# Altium project 无刷电机驱动.PrjPcb
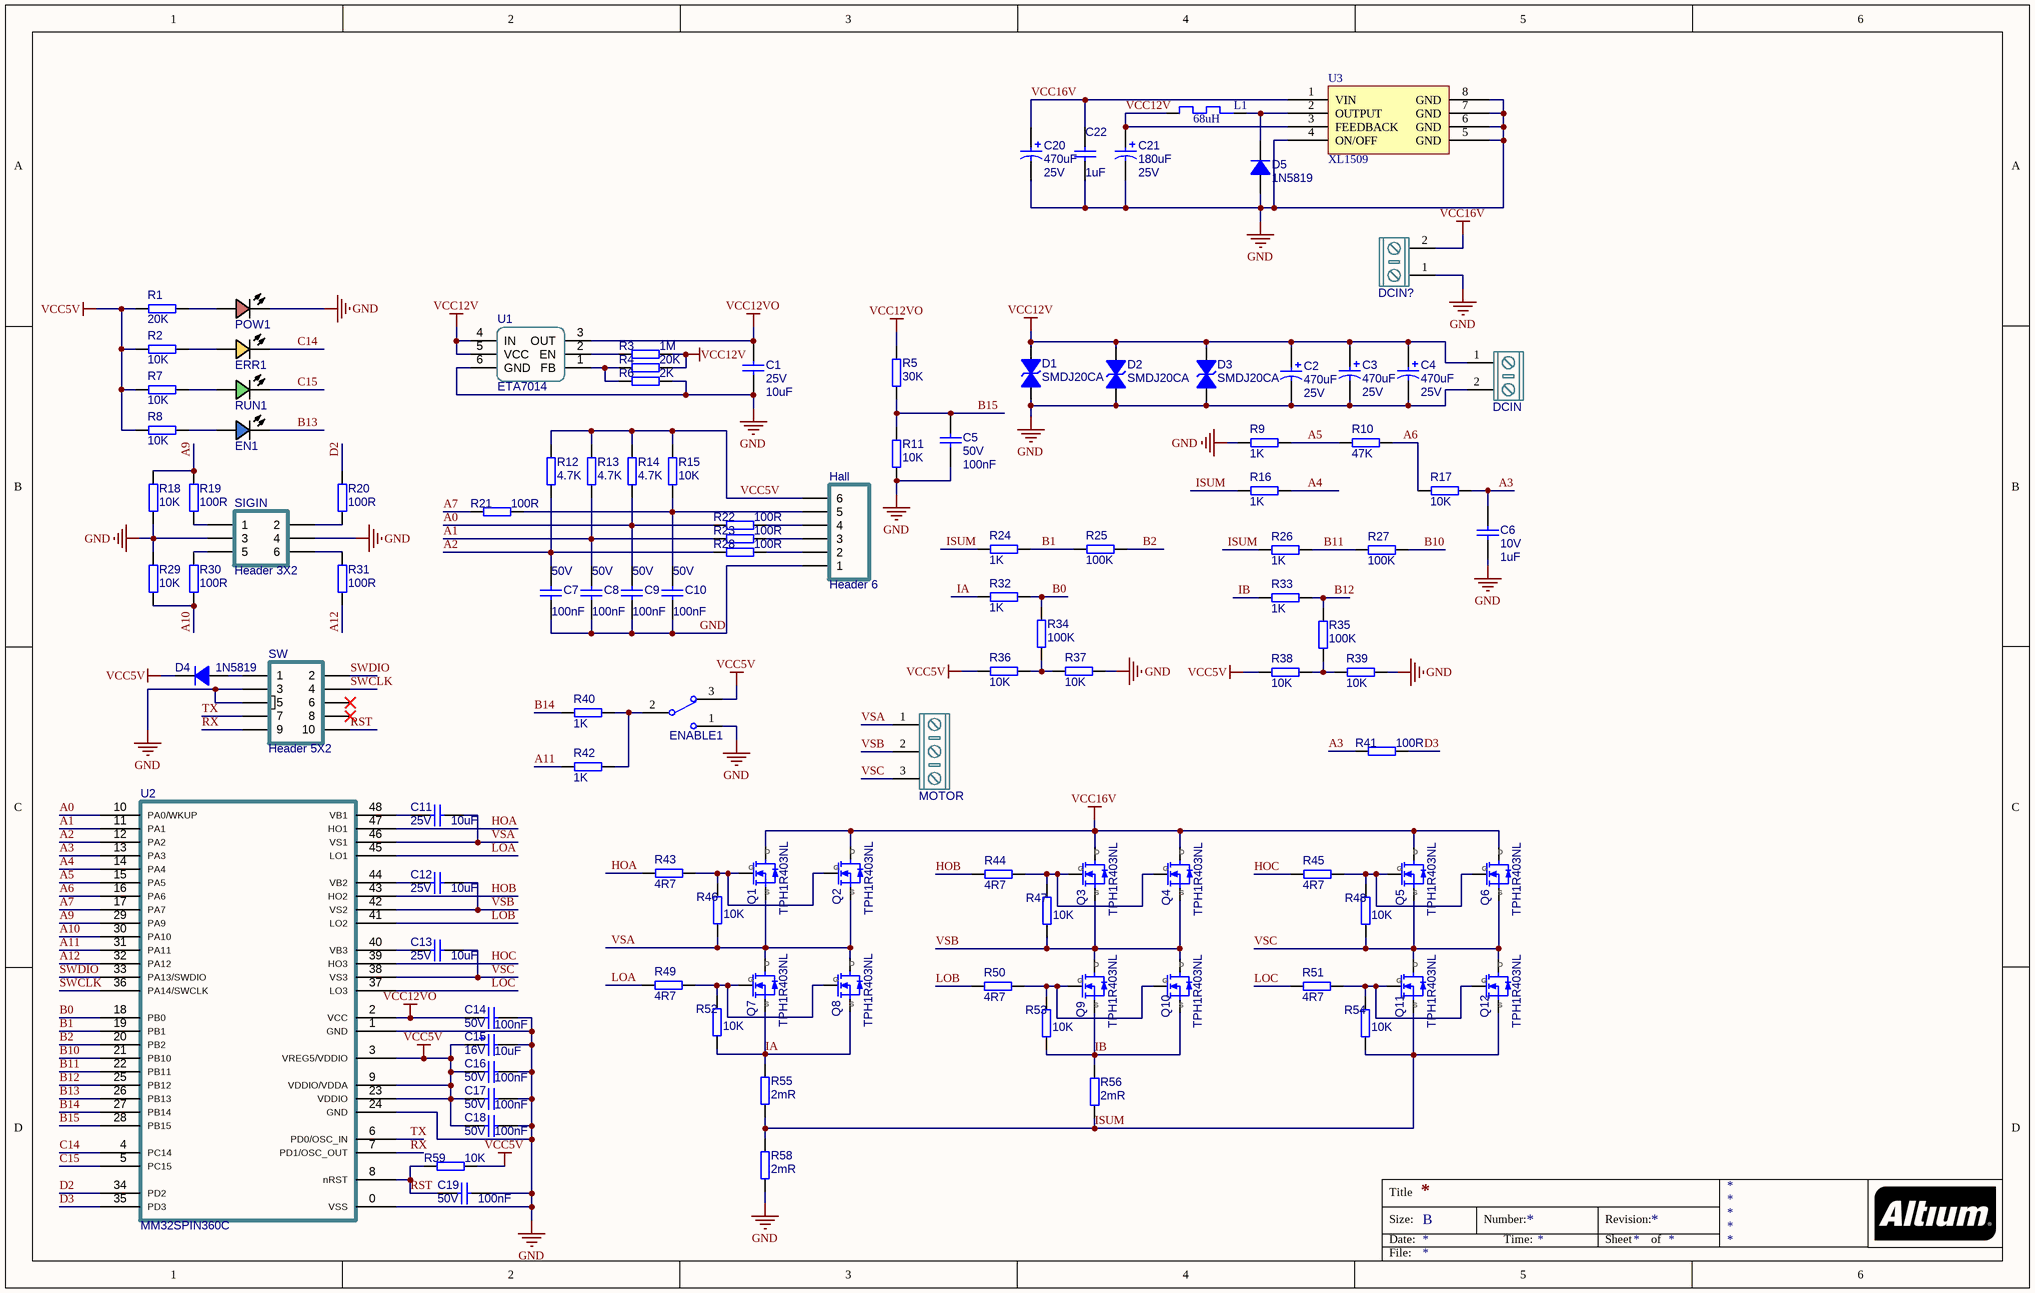
[diagram p0: Sheet1.SchDoc]
1 sheet, 112 parts. Net scope: global (net labels, ports and power ports of the same name join across sheets).
Board file: 四层板V2.0.PcbDoc

## Sheet Sheet1.SchDoc
size B

### Parts
C1  value 10uF  Voltage: 25V  [CAPC2012[0805]S-N]  (hidden comment: 10uF ±10% 25V)
C2  value 470uF  Voltage: 25V  [CAPPR3.5-8X12]  (hidden comment: 470uF 25V)
C3  value 470uF  Voltage: 25V  [CAPPR3.5-8X12]  (hidden comment: 470uF 25V)
C4  value 470uF  Voltage: 25V  [CAPPR3.5-8X12]  (hidden comment: 470uF 25V)
C5  value 100nF  Voltage: 50V  [RESC1608[0603]S-N]  (hidden comment: 100nF ±10% 50V)
C6  value 1uF  Voltage: 10V  [RESC1608[0603]S-N]  (hidden comment: 1uF ±10% 10V)
C7  value 100nF  Voltage: 50V  [RESC1608[0603]S-N]  (hidden comment: 100nF ±10% 50V)
C8  value 100nF  Voltage: 50V  [RESC1608[0603]S-N]  (hidden comment: 100nF ±10% 50V)
C9  value 100nF  Voltage: 50V  [RESC1608[0603]S-N]  (hidden comment: 100nF ±10% 50V)
C10  value 100nF  Voltage: 50V  [RESC1608[0603]S-N]  (hidden comment: 100nF ±10% 50V)
C11  value 10uF  Voltage: 25V  [CAPC2012[0805]S-N]  (hidden comment: 10uF ±10% 25V)
C12  value 10uF  Voltage: 25V  [CAPC2012[0805]S-N]  (hidden comment: 10uF ±10% 25V)
C13  value 10uF  Voltage: 25V  [CAPC2012[0805]S-N]  (hidden comment: 10uF ±10% 25V)
C14  value 100nF  Voltage: 50V  [RESC1608[0603]S-N]  (hidden comment: 100nF ±10% 50V)
C15  value 10uF  Voltage: 16V  [CAPT3216]  (hidden comment: 10uF 16V)
C16  value 100nF  Voltage: 50V  [RESC1608[0603]S-N]  (hidden comment: 100nF ±10% 50V)
C17  value 100nF  Voltage: 50V  [RESC1608[0603]S-N]  (hidden comment: 100nF ±10% 50V)
C18  value 100nF  Voltage: 50V  [RESC1608[0603]S-N]  (hidden comment: 100nF ±10% 50V)
C19  value 100nF  Voltage: 50V  [RESC1608[0603]S-N]  (hidden comment: 100nF ±10% 50V)
C20  value 470uF  Voltage: 25V  [CAPPR3.5-8X12]  (hidden comment: 470uF 25V)
C21  value 180uF  Voltage: 25V  [CAPPR3.5-8X12]  (hidden comment: 180uF 25V)
C22  value 1uF  [CAPC2012[0805]S-N]  (hidden comment: 1uF ±10% 25V)
D1  SMDJ20CA  [SMC[DO-214AB]]
D2  SMDJ20CA  [SMC[DO-214AB]]
D3  SMDJ20CA  [SMC[DO-214AB]]
D4  1N5819  [SOD-123-L]
D5  1N5819  [SOD-123-L]
DCIN  KF/WJ/DG 30x connecter  [KF/WJ/DG 301-2p-5.0mm]  (value not drawn)
DCIN?  KF/WJ/DG 30x connecter  [KF/WJ/DG 301-2p-5.0mm]  (value not drawn)
EN1  蓝色贴片LED  [CAPC2012[0805]S-N]  (value not drawn)
ENABLE1  SW-SPDT  [SS12D10]  (value not drawn)
ERR1  黄色贴片LED  [CAPC2012[0805]S-N]  (value not drawn)
Hall  Header 6  [ZH1.5-WF-6P]
L1  68uH  [L1]
MOTOR  KF/WJ/DG 30x connecter  [KF/WJ/DG 301-3p-5.0mm]  (value not drawn)
POW1  红色贴片LED  [CAPC2012[0805]S-N]  (value not drawn)
Q1  TPH1R403NL  [DFN5x6]
Q2  TPH1R403NL  [DFN5x6]
Q3  TPH1R403NL  [DFN5x6]
Q4  TPH1R403NL  [DFN5x6]
Q5  TPH1R403NL  [DFN5x6]
Q6  TPH1R403NL  [DFN5x6]
Q7  TPH1R403NL  [DFN5x6]
Q8  TPH1R403NL  [DFN5x6]
Q9  TPH1R403NL  [DFN5x6]
Q10  TPH1R403NL  [DFN5x6]
Q11  TPH1R403NL  [DFN5x6]
Q12  TPH1R403NL  [DFN5x6]
R1  value 20K  [RESC1608[0603]S-N]  (hidden comment: 20K ±1%)
R2  value 10K  [RESC1608[0603]S-N]  (hidden comment: 10K ±1%)
R3  value 1M  [RESC1608[0603]S-N]  (hidden comment: 1M ±1%)
R4  value 20K  [RESC1608[0603]S-N]  (hidden comment: 20K ±1%)
R5  value 30K  [RESC1608[0603]S-N]  (hidden comment: 30K ±1%)
R6  value 2K  [RESC1608[0603]S-N]  (hidden comment: 2K ±1%)
R7  value 10K  [RESC1608[0603]S-N]  (hidden comment: 10K ±1%)
R8  value 10K  [RESC1608[0603]S-N]  (hidden comment: 10K ±1%)
R9  value 1K  [RESC1608[0603]S-N]  (hidden comment: 1K ±1%)
R10  value 47K  [RESC1608[0603]S-N]  (hidden comment: 47K ±1%)
R11  value 10K  [RESC1608[0603]S-N]  (hidden comment: 10K ±1%)
R12  value 4.7K  [RESC1608[0603]S-N]  (hidden comment: 4.7K ±1%)
R13  value 4.7K  [RESC1608[0603]S-N]  (hidden comment: 4.7K ±1%)
R14  value 4.7K  [RESC1608[0603]S-N]  (hidden comment: 4.7K ±1%)
R15  value 10K  [RESC1608[0603]S-N]  (hidden comment: 10K ±1%)
R16  value 1K  [RESC1608[0603]S-N]  (hidden comment: 1K ±1%)
R17  value 10K  [RESC1608[0603]S-N]  (hidden comment: 10K ±1%)
R18  value 10K  [RESC1608[0603]S-N]  (hidden comment: 10K ±1%)
R19  value 100R  [RESC1608[0603]S-N]  (hidden comment: 100R ±1%)
R20  value 100R  [RESC1608[0603]S-N]  (hidden comment: 100R ±1%)
R21  value 100R  [RESC1608[0603]S-N]  (hidden comment: 100R ±1%)
R22  value 100R  [RESC1608[0603]S-N]  (hidden comment: 100R ±1%)
R23  value 100R  [RESC1608[0603]S-N]  (hidden comment: 100R ±1%)
R24  value 1K  [RESC1608[0603]S-N]  (hidden comment: 1K ±1%)
R25  value 100K  [RESC1608[0603]S-N]  (hidden comment: 100K ±1%)
R26  value 1K  [RESC1608[0603]S-N]  (hidden comment: 1K ±1%)
R27  value 100K  [RESC1608[0603]S-N]  (hidden comment: 100K ±1%)
R28  value 100R  [RESC1608[0603]S-N]  (hidden comment: 100R ±1%)
R29  value 10K  [RESC1608[0603]S-N]  (hidden comment: 10K ±1%)
R30  value 100R  [RESC1608[0603]S-N]  (hidden comment: 100R ±1%)
R31  value 100R  [RESC1608[0603]S-N]  (hidden comment: 100R ±1%)
R32  value 1K  [RESC1608[0603]S-N]  (hidden comment: 1K ±1%)
R33  value 1K  [RESC1608[0603]S-N]  (hidden comment: 1K ±1%)
R34  value 100K  [RESC1608[0603]S-N]  (hidden comment: 100K ±1%)
R35  value 100K  [RESC1608[0603]S-N]  (hidden comment: 100K ±1%)
R36  value 10K  [RESC1608[0603]S-N]  (hidden comment: 10K ±1%)
R37  value 10K  [RESC1608[0603]S-N]  (hidden comment: 10K ±1%)
R38  value 10K  [RESC1608[0603]S-N]  (hidden comment: 10K ±1%)
R39  value 10K  [RESC1608[0603]S-N]  (hidden comment: 10K ±1%)
R40  value 1K  [RESC1608[0603]S-N]  (hidden comment: 1K ±1%)
R41  value 100R  [RESC1608[0603]S-N]  (hidden comment: 100R ±1%)
R42  value 1K  [RESC1608[0603]S-N]  (hidden comment: 1K ±1%)
R43  value 4R7  [RESC1608[0603]S-N]  (hidden comment: 4R7 ±1%)
R44  value 4R7  [RESC1608[0603]S-N]  (hidden comment: 4R7 ±1%)
R45  value 4R7  [RESC1608[0603]S-N]  (hidden comment: 4R7 ±1%)
R46  value 10K  [RESC1608[0603]S-N]  (hidden comment: 10K ±1%)
R47  value 10K  [RESC1608[0603]S-N]  (hidden comment: 10K ±1%)
R48  value 10K  [RESC1608[0603]S-N]  (hidden comment: 10K ±1%)
R49  value 4R7  [RESC1608[0603]S-N]  (hidden comment: 4R7 ±1%)
R50  value 4R7  [RESC1608[0603]S-N]  (hidden comment: 4R7 ±1%)
R51  value 4R7  [RESC1608[0603]S-N]  (hidden comment: 4R7 ±1%)
R52  value 10K  [RESC1608[0603]S-N]  (hidden comment: 10K ±1%)
R53  value 10K  [RESC1608[0603]S-N]  (hidden comment: 10K ±1%)
R54  value 10K  [RESC1608[0603]S-N]  (hidden comment: 10K ±1%)
R55  value 2mR  [RESC6332[2512]S]  (hidden comment: 2mR ±1%)
R56  value 2mR  [RESC6332[2512]S]  (hidden comment: 2mR ±1%)
R58  value 2mR  [RESC6332[2512]S]  (hidden comment: 2mR ±1%)
R59  value 10K  [RESC1608[0603]S-N]  (hidden comment: 10K ±1%)
RUN1  翠绿贴片LED  [CAPC2012[0805]S-N]  (value not drawn)
SIGIN  Header 3X2  [HDR2X3]
SW  Header 5X2  [HDR2X5]
U1  ETA7014  [SOT-23-6]
U2  MM32SPIN360C  [QFN48-6x6]
U3  XL1509  [XL1509]

### Nets
GND: C1.2 C2.2 C3.2 C4.2 C5.1 C6.1 C7.1 C8.1 C9.1 C10.1 C14.1 C15.2 C16.1 C17.1 C18.1 C19.1 C20.2 C21.2 C22.2 D1.A D2.A D3.A D5.A DCIN.2 DCIN?.1 ENABLE1.1 Hall.1 POW1.2 R6.2 R9.1 R11.1 R18.1 R29.2 R37.2 R39.2 R58.1 SIGIN.3 SIGIN.4 SW.3 SW.5 U1.6(GND) U2.0(VSS) U2.1(GND) U2.24(GND) U3.4(ON/OFF) U3.5(GND) U3.6(GND) U3.7(GND) U3.8(GND)
VCC5V: C15.1 C16.2 C17.2 C18.2 D4.K ENABLE1.3 Hall.6 R1.1 R2.1 R7.1 R8.1 R12.2 R13.2 R14.2 R15.2 R36.1 R38.1 R59.2 U2.3(VREG5/VDDIO) U2.9(VDDIO/VDDA) U2.23(VDDIO)
VCC12V: C2.1 C3.1 C4.1 C21.1 D1.K D2.K D3.K DCIN.1 L1.1 R3.2 R4.2 U1.4(IN) U1.5(VCC) U3.3(FEEDBACK)
VCC12VO: C1.1 C14.2 R5.1 U1.3(OUT) U2.2(VCC)
VCC16V: C20.1 C22.1 DCIN?.2 Q1.1(D) Q2.1(D) Q3.1(D) Q4.1(D) Q5.1(D) Q6.1(D) U3.1(VIN)
A0: C9.2 R14.1 R22.1 U2.10(PA0/WKUP)
A1: C8.2 R13.1 R23.1 U2.11(PA1)
A2: C7.2 R12.1 R28.1 U2.12(PA2)
A3: C6.2 R17.2 R41.1 U2.13(PA3)
A4: R16.2 U2.14(PA4)
A5: R9.2 R10.1 U2.15(PA5)
A6: R10.2 R17.1 U2.16(PA6)
A7: R21.1 U2.17(PA7)
A9: R18.2 R19.2 U2.29(PA9)
A10: R29.1 R30.1 U2.30(PA10)
A11: R42.1 U2.31(PA11)
A12: R31.2 U2.32(PA12)
B0: R32.2 R34.2 U2.18(PB0)
B1: R24.2 R25.1 U2.19(PB1)
B2: R25.2 U2.20(PB2)
B10: R27.2 U2.21(PB10)
B11: R26.2 R27.1 U2.22(PB11)
B12: R33.2 R35.2 U2.25(PB12)
B13: EN1.2 U2.26(PB13)
B14: R40.1 U2.27(PB14)
B15: C5.2 R5.2 R11.2 U2.28(PB15)
C14: ERR1.2 U2.4(PC14)
C15: RUN1.2 U2.5(PC15)
D2: R20.2 U2.34(PD2)
D3: R41.2 U2.35(PD3)
HOA: R43.1 U2.47(HO1)
HOB: R44.1 U2.43(HO2)
HOC: R45.1 U2.39(HO3)
IA: Q7.3(S) Q8.3(S) R32.1 R52.1 R55.2
IB: Q9.3(S) Q10.3(S) R33.1 R53.1 R56.2
ISUM: Q11.3(S) Q12.3(S) R16.1 R24.1 R26.1 R54.1 R55.1 R56.1 R58.2
LOA: R49.1 U2.45(LO1)
LOB: R50.1 U2.41(LO2)
LOC: R51.1 U2.37(LO3)
RST: C19.2 R59.1 SW.10 U2.8(nRST)
RX: SW.9 U2.7(PD1/OSC_OUT)
SWCLK: SW.4 U2.36(PA14/SWCLK)
SWDIO: SW.2 U2.33(PA13/SWDIO)
TX: SW.7 U2.6(PD0/OSC_IN)
VSA: C11.2 MOTOR.1 Q1.3(S) Q2.3(S) Q7.1(D) Q8.1(D) R46.1 U2.46(VS1)
VSB: C12.2 MOTOR.2 Q3.3(S) Q4.3(S) Q9.1(D) Q10.1(D) R47.1 U2.42(VS2)
VSC: C13.2 MOTOR.3 Q5.3(S) Q6.3(S) Q11.1(D) Q12.1(D) R48.1 U2.38(VS3)
NetC10_2: C10.2 Hall.5 R15.1 R21.2
NetC11_1: C11.1 U2.48(VB1)
NetC12_1: C12.1 U2.44(VB2)
NetC13_1: C13.1 U2.40(VB3)
NetD4_A: D4.A SW.1
NetD5_K: D5.K L1.2 U3.2(OUTPUT)
NetEN1_1: EN1.1 R8.2
NetENABLE1_2: ENABLE1.2 R40.2 R42.2
NetERR1_1: ERR1.1 R2.2
NetHall_2: Hall.2 R28.2
NetHall_3: Hall.3 R23.2
NetHall_4: Hall.4 R22.2
NetPOW1_1: POW1.1 R1.2
NetQ1_2: Q1.2(G) Q2.2(G) R43.2 R46.2
NetQ3_2: Q3.2(G) Q4.2(G) R44.2 R47.2
NetQ5_2: Q5.2(G) Q6.2(G) R45.2 R48.2
NetQ7_2: Q7.2(G) Q8.2(G) R49.2 R52.2
NetQ9_2: Q9.2(G) Q10.2(G) R50.2 R53.2
NetQ11_2: Q11.2(G) Q12.2(G) R51.2 R54.2
NetR3_1: R3.1 U1.2(EN)
NetR4_1: R4.1 R6.1 U1.1(FB)
NetR7_2: R7.2 RUN1.1
NetR19_1: R19.1 SIGIN.1
NetR20_1: R20.1 SIGIN.2
NetR30_2: R30.2 SIGIN.5
NetR31_1: R31.1 SIGIN.6
NetR34_1: R34.1 R36.2 R37.1
NetR35_1: R35.1 R38.2 R39.1

Not connected (* = marked no-connect by the designer): SW 6* 8*

### Notes on the sheet
- Title
- Size:
- Date:
- B
- Number:
- Time:
- Revision:
- Sheet
- of
- File:

### Library data of the parts
C1 C11-C13 C22 = Cap-Chip: 贴片电容; Published: 2020-12-18; Revision: V1.1; Tolerance: ±10%
  C22: Voltage: 25V
C2-C4 C20 C21 = Cap-Elect: Polarized Capacitor (Radial); Published: 8-Jun-2000; Revision: July-2002: Re-released for DXP Platform.; Publisher: Altium Limited; Price(RMB): 0.000
C5 C7-C10 C14 C16-C19 = Cap-Chip_1: 贴片电容; Published: 2020-12-18; Revision: V1.1; Tolerance: ±10%
C6 = Cap-Chip_2: 贴片电容; Published: 2020-12-18; Revision: V1.1; Tolerance: ±10%
C15 = Cap-Tan: Tantalum Capacitor; Published: 8-Jun-2000; Revision: July-2002: Re-released for DXP Platform.; Publisher: Altium Limited; Price(RMB): 0.000
D1-D3 = Diode TVS Bi-Dir: TRANSIENT VOLTAGE  SUPPRESSOR DIODE; Imax: 500mA; Published: 8-Jun-2000; Publisher: Altium Limited; Price(RMB): 0.000
D4 D5 = Diode: 普通二极管 Diode; Imax: 500mA; Published: 8-Jun-2000; Revision: July-2002: Re-released for DXP Platform.; Publisher: Altium Limited; Price(RMB): 0.000
DCIN DCIN? = KF/WJ/DG 30x: 接线端子 2Pin
EN1 = LED Chip Blue: Published: 8-Jun-2000; Revision: July-2002: Re-released for DXP Platform.; Publisher: Altium Limited; Price(RMB): 0.00; Color: Blue
ENABLE1 = SW-SPDT: 单刀双掷开关 3脚船型、钮子、拨动开关 SPDT Subminiature Toggle Switch; Published: 24-Mar-1999; Publisher: Altium Limited; Price(RMB): 0.000
ERR1 = LED Chip Yellow: Published: 8-Jun-2000; Revision: July-2002: Re-released for DXP Platform.; Publisher: Altium Limited; Price(RMB): 0.00
Hall = Header 6: Header, 6-Pin; LatestRevisionDate: 17-Jul-2002; LatestRevisionNote: Re-released for DXP Platform.; Publisher: Altium Limited; Price(RMB): 0.00
L1 = 电感
MOTOR = KF/WJ/DG 30x-3P: 接线端子 3Pin
POW1 = LED Chip Red: Published: 8-Jun-2000; Revision: July-2002: Re-released for DXP Platform.; Publisher: Altium Limited; Price(RMB): 0.00
Q1-Q12 = TPH1R403NL: 东芝 N沟 MOS
R1 R4 = Res-Chip_2: 贴片电阻; Published: 8-Jun-2000; Revision: July-2002: Re-released for DXP Platform.; Tolerance: ±1%
R2 R7 R8 R11 R17 R18 R29 R36-R39 R46-R48 R52-R54 R59 = Res-Chip: 贴片电阻; Published: 8-Jun-2000; Revision: July-2002: Re-released for DXP Platform.; Tolerance: ±1%
R3 = Res-Chip_6: 贴片电阻; Published: 8-Jun-2000; Revision: July-2002: Re-released for DXP Platform.; Tolerance: ±1%
R5 = Res-Chip_1: 贴片电阻; Published: 8-Jun-2000; Revision: July-2002: Re-released for DXP Platform.; Tolerance: ±1%
R6 = Res-Chip_9: 贴片电阻; Published: 8-Jun-2000; Revision: July-2002: Re-released for DXP Platform.; Tolerance: ±1%
R9 R16 R24 R26 R32 R33 R40 R42 = Res-Chip_3: 贴片电阻; Published: 8-Jun-2000; Revision: July-2002: Re-released for DXP Platform.; Tolerance: ±1%
R10 = Res-Chip_4: 贴片电阻; Published: 8-Jun-2000; Revision: July-2002: Re-released for DXP Platform.; Tolerance: ±1%
R12-R15 = Res-Chip_7: 贴片电阻; Published: 8-Jun-2000; Revision: July-2002: Re-released for DXP Platform.; Tolerance: ±1%
R19-R23 R28 R30 R31 R41 = Res-Chip_8: 贴片电阻; Published: 8-Jun-2000; Revision: July-2002: Re-released for DXP Platform.; Tolerance: ±1%
R25 R27 R34 R35 = Res-Chip_5: 贴片电阻; Published: 8-Jun-2000; Revision: July-2002: Re-released for DXP Platform.; Tolerance: ±1%
R43-R45 R49-R51 = Res-Chip_10: 贴片电阻; Published: 8-Jun-2000; Revision: July-2002: Re-released for DXP Platform.; Tolerance: ±1%
R55 R56 R58 = Res-Chip_11: 贴片电阻; Published: 8-Jun-2000; Revision: July-2002: Re-released for DXP Platform.; Tolerance: ±1%
RUN1 = LED Chip Green: Published: 8-Jun-2000; Revision: July-2002: Re-released for DXP Platform.; Publisher: Altium Limited; Price(RMB): 0.00
SIGIN = Header 3X2: Header, 3-Pin, Dual row; LatestRevisionDate: 17-Jul-2002; LatestRevisionNote: Re-released for DXP Platform.; Publisher: Altium Limited; Price(RMB): 0.00
SW = Header 5X2: Header, 5-Pin, Dual row; LatestRevisionDate: 17-Jul-2002; LatestRevisionNote: Re-released for DXP Platform.; Publisher: Altium Limited; Price(RMB): 0.00
U1 = ETA7014: ETA7014 OVP芯片
U2 = MM32SPIN360C: Published: 30-May-2008; DatasheetVersion: rev6, Mar-2008; PackageVersion: Mar-2008; PackageReference: LQFP48; Publisher: Altium Limited; PackageDescription: 48-Pin Low-Profile Quad Flat Pack, 7 x 7 mm Body, 0.5 mm Pitch (LQFP48); ComponentLink1Description: Manufacturer Link; ComponentLink1URL: www.st.com/stm32; ComponentLink2Description: Datasheet; ComponentLink2URL: http://www.st.com/stonline/products/literature/ds/13587.pdf